# EAGLE design mod_io (EAGLE 7.5.0)
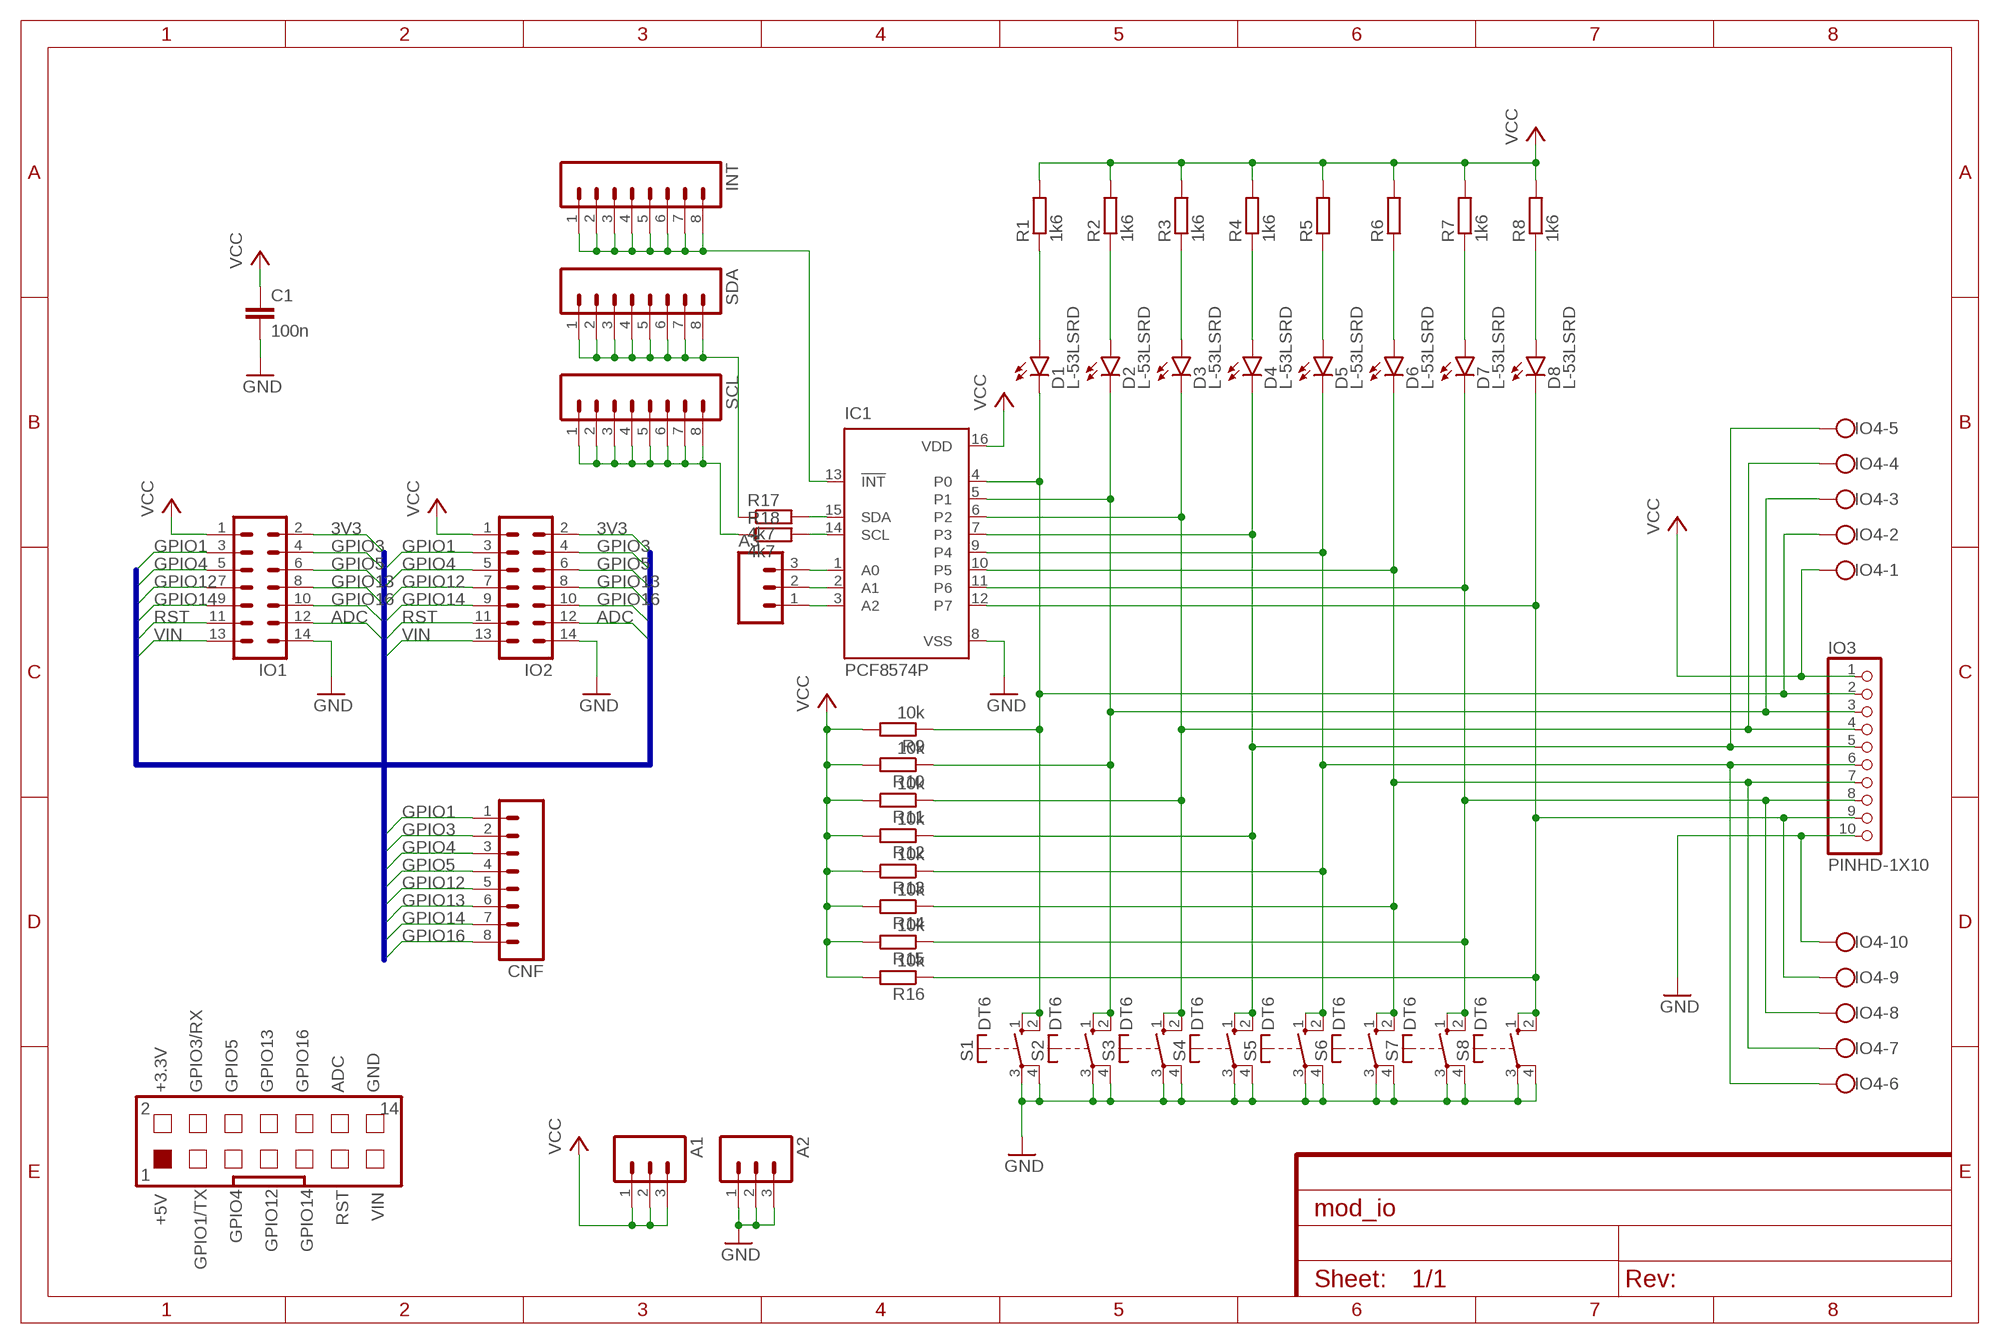
[diagram p0: schematic, sheet 1]
FRAME1 (FRAME-A4L): CNAME: I/O Expander for IoT Module; CREVISION: 1; DESIGNER: M.Vagovszky

## Parts
A1  M03LONGPADS  [1X03_LONGPADS]
A2  M03LONGPADS  [1X03_LONGPADS]
A3  M03LONGPADS  [1X03_LONGPADS]
C1  100n  C-EU050-025X075  [C050-025X075]
CNF  M08LONGPADS  [1X08_LONGPADS]
D1  L-53LSRD  LED5MM  [LED5MM]
D2  L-53LSRD  LED5MM  [LED5MM]
D3  L-53LSRD  LED5MM  [LED5MM]
D4  L-53LSRD  LED5MM  [LED5MM]
D5  L-53LSRD  LED5MM  [LED5MM]
D6  L-53LSRD  LED5MM  [LED5MM]
D7  L-53LSRD  LED5MM  [LED5MM]
D8  L-53LSRD  LED5MM  [LED5MM]
IC1  PCF8574P  [DIL16]
INT  M08LONGPADS  [1X08_LONGPADS]
IO1  14V  [14V]
IO2  14V  [14V]
IO3  PINHD-1X10  [1X10-BIG]
IO4  AK550/10  [AK550/10]
R1  1k6  R-EU_0207/10  [0207/10]
R2  1k6  R-EU_0207/10  [0207/10]
R3  1k6  R-EU_0207/10  [0207/10]
R4  1k6  R-EU_0207/10  [0207/10]
R5  R-EU_0207/10  [0207/10]
R6  R-EU_0207/10  [0207/10]
R7  1k6  R-EU_0207/10  [0207/10]
R8  1k6  R-EU_0207/10  [0207/10]
R9  10k  R-EU_0207/10  [0207/10]
R10  10k  R-EU_0207/10  [0207/10]
R11  10k  R-EU_0207/10  [0207/10]
R12  10k  R-EU_0207/10  [0207/10]
R13  10k  R-EU_0207/10  [0207/10]
R14  10k  R-EU_0207/10  [0207/10]
R15  10k  R-EU_0207/10  [0207/10]
R16  10k  R-EU_0207/10  [0207/10]
R17  4k7  R-EU_0207/10  [0207/10]
R18  4k7  R-EU_0207/10  [0207/10]
S1  DT6  [DT6]
S2  DT6  [DT6]
S3  DT6  [DT6]
S4  DT6  [DT6]
S5  DT6  [DT6]
S6  DT6  [DT6]
S7  DT6  [DT6]
S8  DT6  [DT6]
SCL  M08LONGPADS  [1X08_LONGPADS]
SDA  M08LONGPADS  [1X08_LONGPADS]

## Nets
3V3: IO1.2 IO2.2
ADC: IO1.12 IO2.12
GND: A2.1 A2.2 A2.3 C1.2 IC1.8(VSS) IO1.14 IO2.14 IO3.10 IO4.10 S1.3(P) S1.4(P) S2.3(P) S2.4(P) S3.3(P) S3.4(P) S4.3(P) S4.4(P) S5.3(P) S5.4(P) S6.3(P) S6.4(P) S7.3(P) S7.4(P) S8.3(P) S8.4(P)
GPIO1: CNF.1 IO1.3 IO2.3
GPIO3: CNF.2 IO1.4 IO2.4
GPIO4: CNF.3 IO1.5 IO2.5
GPIO5: CNF.4 IO1.6 IO2.6
GPIO12: CNF.5 IO1.7 IO2.7
GPIO13: CNF.6 IO1.8 IO2.8
GPIO14: CNF.7 IO1.9 IO2.9
GPIO16: CNF.8 IO1.10 IO2.10
N$1: D5.K(C) IC1.9(P4) IO3.6 IO4.6 R13.1 S5.1(S) S5.2(S)
N$2: D6.K(C) IC1.10(P5) IO3.7 IO4.7 R14.1 S6.1(S) S6.2(S)
N$3: D1.K(C) IC1.4(P0) IO3.2 IO4.2 R9.1 S1.1(S) S1.2(S)
N$4: D2.K(C) IC1.5(P1) IO3.3 IO4.3 R10.1 S2.1(S) S2.2(S)
N$5: D3.K(C) IC1.6(P2) IO3.4 IO4.4 R11.1 S3.1(S) S3.2(S)
N$6: D4.K(C) IC1.7(P3) IO3.5 IO4.5 R12.1 S4.1(S) S4.2(S)
N$7: D7.K(C) IC1.11(P6) IO3.8 IO4.8 R15.1 S7.1(S) S7.2(S)
N$8: D8.K(C) IC1.12(P7) IO3.9 IO4.9 R16.1 S8.1(S) S8.2(S)
N$9: D6.A R6.1
N$10: D5.A R5.1
N$11: D7.A R7.1
N$12: D8.A R8.1
N$13: D1.A R1.1
N$14: D2.A R2.1
N$15: D3.A R3.1
N$16: D4.A R4.1
N$17: IC1.13(!INT) INT.1 INT.2 INT.3 INT.4 INT.5 INT.6 INT.7 INT.8
N$18: A3.3 IC1.1(A0)
N$19: A3.2 IC1.2(A1)
N$20: A3.1 IC1.3(A2)
N$21: IC1.15(SDA) R17.2
N$22: IC1.14(SCL) R18.2
N$23: R17.1 SDA.1 SDA.2 SDA.3 SDA.4 SDA.5 SDA.6 SDA.7 SDA.8
N$25: R18.1 SCL.1 SCL.2 SCL.3 SCL.4 SCL.5 SCL.6 SCL.7 SCL.8
RST: IO1.11 IO2.11
VCC: A1.1 A1.2 A1.3 C1.1 IC1.16(VDD) IO1.1 IO2.1 IO3.1 IO4.1 R1.2 R2.2 R3.2 R4.2 R5.2 R6.2 R7.2 R8.2 R9.2 R10.2 R11.2 R12.2 R13.2 R14.2 R15.2 R16.2
VIN: IO1.13 IO2.13

## Buses
BUS:RST,ADC,GPIO16,GPIO[4..5],GPIO[12..14],GPIO1,GPIO3,VIN,3V3

## Notes on the sheet
- +3.3V | GPIO3/RX | GPIO5 | GPIO13 | GPIO16 | ADC | GND
- 2 | 14
- 1
- +5V | RST | VIN
- GPIO4
- GPIO12 | GPIO14
- GPIO1/TX

## Library data of the parts
A1-A3 = SparkFun-Connectors:M03: Header 3 Standard 3-pin 0.1" header. Use with straight break away headers (SKU : PRT-00116), right angle break away headers (PRT-00553), swiss pins (PRT-00743), machine pins (PRT-00117), and female headers (PRT-00115). Molex polarized connector foot print use with SKU : PRT-08232 with associated crimp pins and housings.
C1 = rcl:C-EU: CAPACITOR, European symbol
CNF INT SCL SDA = SparkFun-Connectors:M08: Header 8 Standard 8-pin 0.1" header. Use with straight break away headers (SKU : PRT-00116), right angle break away headers (PRT-00553), swiss pins (PRT-00743), machine pins (PRT-00117), and female headers (PRT-00115).
D1-D8 = SparkFun-LED:LED: LEDs Standard schematic elements and footprints for 5mm, 3mm, 1206, and 0603 sized LEDs. 5mm - Spark Fun Electronics SKU : COM-00529 (and others)
IC1 = micro-philips:PCF8574: I2C-Bus Remote 8-bit I/O expander http://www.semiconductors.philips.com/acrobat_download/datasheets/PCF8574_4.pdf; MPN: PCF8574PN; OC_FARNELL: 204020; OC_NEWARK: 11N8515
IO1 IO2 = con-harting-v:14V: CONNECTOR; OC_FARNELL: unknown; OC_NEWARK: unknown
IO3 = adafruit:PINHD-1X10: Pin header 1x10 0.1" spacing With round pins
IO4 = con-ptr500+:AK550/10: CONNECTOR
R1-R18 = resistor:R-EU_: RESISTOR, European symbol
S1-S8 = switch-misc:DT: ITT SWITCH

## Board
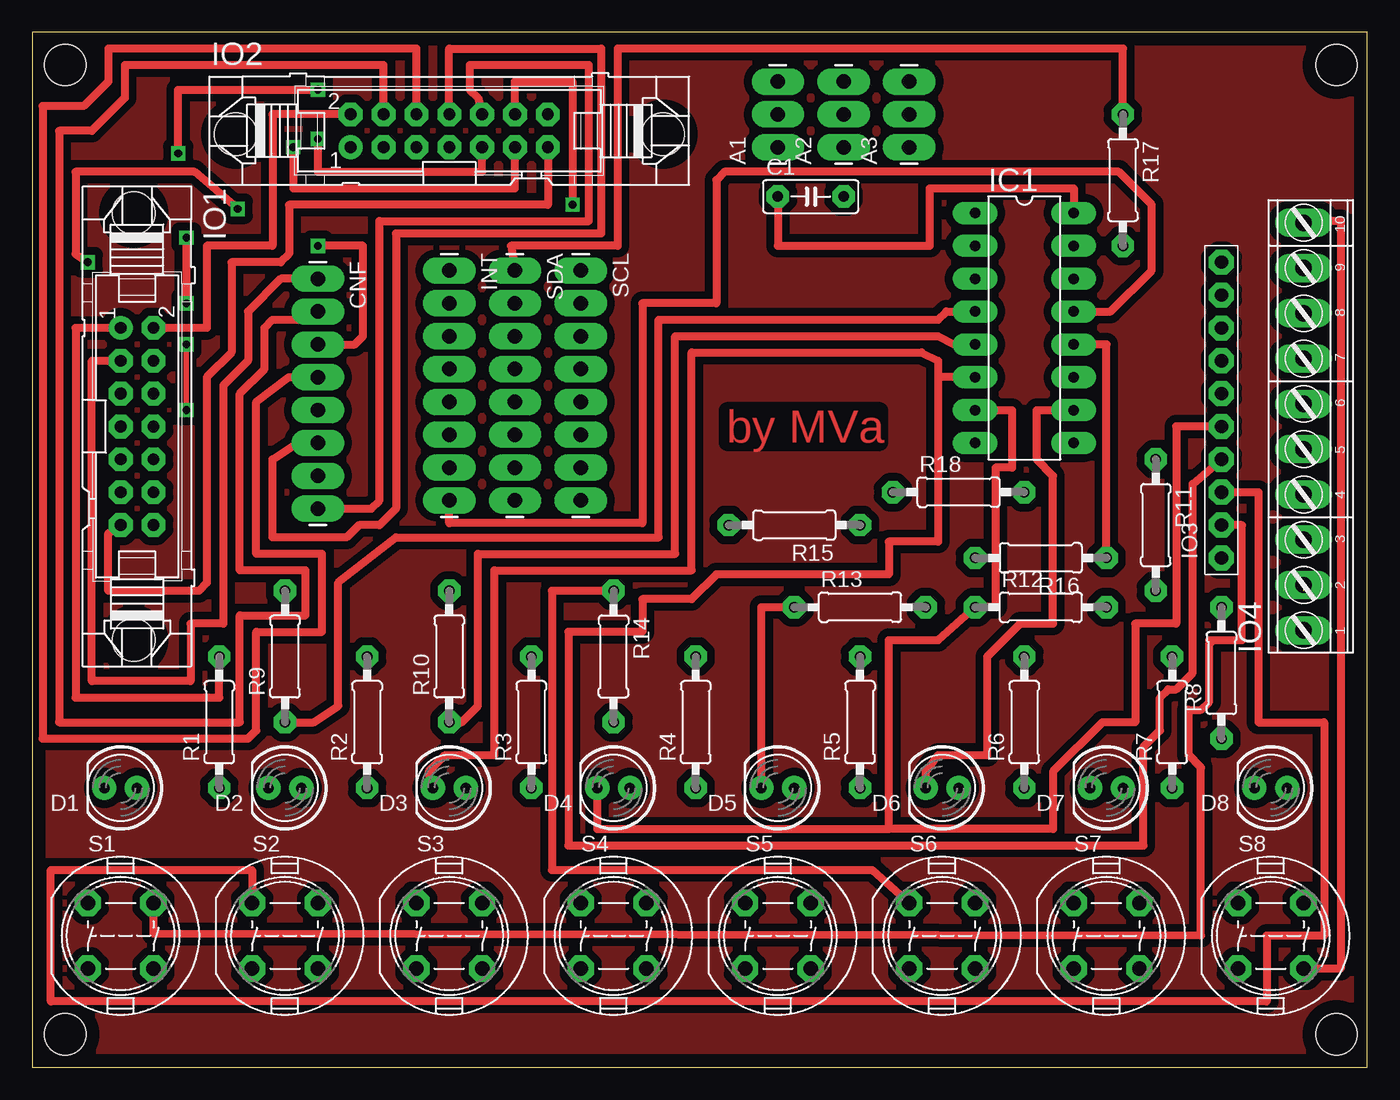
[diagram p1: board, top side]
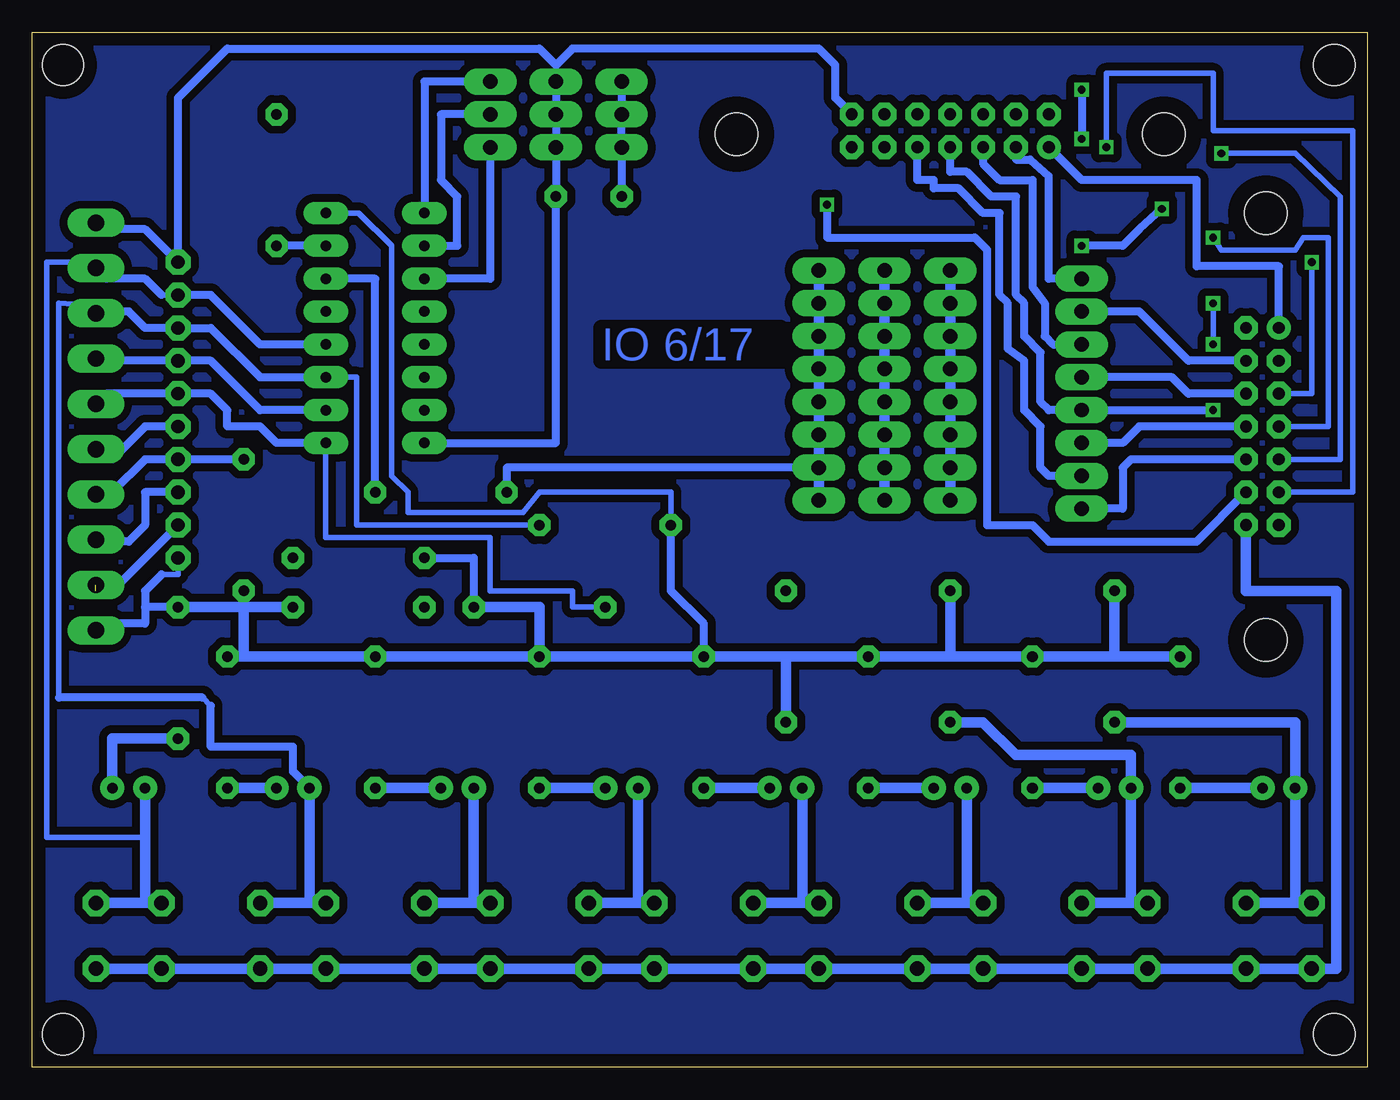
[diagram p2: board, bottom side, seen from below]

Size 103.17 x 80 mm. Coordinates in mm from the lower left corner, seen from the top.
Outline: 0,0 103.17,0 103.17,80 0,80 0,0
Copper layers (1*16): Top 0.035mm / dielectric 1.5mm / Bottom 0.035mm
Design rules "default *": minimum track width 10mil, minimum drill 20mil, track to track 15mil, track to pad 15mil, pad to pad 12mil, via to via 8mil, smd to smd 8mil, copper to edge 40mil, drill to drill 10mil, minimum pad ring 18mil, minimum via ring 10mil, stop-mask expansion 4mil, vias tented up to drill 0mil, thermal gap 10mil
Holes 3.2 mm at 2.54,77.47 100.81,77.47 100.81,2.54 2.54,2.54

### Footprints (pad centres in the part's own frame; a part is rotated, then mirrored left to right if it is on the bottom)
1X03_LONGPADS = drill 1.118 pad 1.88 long: 1 0,0; 2 2.54,0; 3 5.08,0
C050-025X075 = drill 0.813 octagon: 1 -2.54,0; 2 2.54,0
1X08_LONGPADS = drill 1.118 pad 1.88 long: 1 0,0; 2 2.54,0; 3 5.08,0; 4 7.62,0; 5 10.16,0; 6 12.7,0; 7 15.24,0; 8 17.78,0
LED5MM = drill 0.813 pad 1.88: A -1.27,0; K 1.27,0
DIL16 = drill 0.813 long: 1 -8.89,-3.81; 2 -6.35,-3.81; 3 -3.81,-3.81; 4 -1.27,-3.81; 5 1.27,-3.81; 6 3.81,-3.81; 7 6.35,-3.81; 8 8.89,-3.81; 9 8.89,3.81; 10 6.35,3.81; 11 3.81,3.81; 12 1.27,3.81; 13 -1.27,3.81; 14 -3.81,3.81; 15 -6.35,3.81; 16 -8.89,3.81
14V = drill 0.914: 1 -7.62,-1.27 | drill 0.914 octagon: 2 -7.62,1.27; 3 -5.08,-1.27; 4 -5.08,1.27; 5 -2.54,-1.27; 6 -2.54,1.27; 7 0,-1.27; 8 0,1.27; 9 2.54,-1.27; 10 2.54,1.27; 11 5.08,-1.27; 12 5.08,1.27; 13 7.62,-1.27; 14 7.62,1.27 | hole 3.302: 16.51,-0.254; -16.51,-0.254
1X10-BIG = drill 1.016 pad 1.778 octagon: 1 -11.43,0; 2 -8.89,0; 3 -6.35,0; 4 -3.81,0; 5 -1.27,0; 6 1.27,0; 7 3.81,0; 8 6.35,0; 9 8.89,0; 10 11.43,0
AK550/10 = drill 1.27 long: 1 -15.75,0; 2 -12.25,0; 3 -8.75,0; 4 -5.25,0; 5 -1.75,0; 6 1.75,0; 7 5.25,0; 8 8.75,0; 9 12.25,0; 10 15.75,0
0207/10 = drill 0.813 octagon: 1 -5.08,0; 2 5.08,0
DT6 = drill 1.118 octagon: 1 -2.54,2.54; 2 2.54,2.54; 3 2.54,-2.54; 4 -2.54,-2.54

### Placement (x,y rotation side)
A1  57.63,71.12 90 top
A2  62.71,71.12 90 top
A3  67.79,71.12 90 top
C1  60.17,67.31 0 top
CNF  22.07,60.96 270 top
D1  6.83,21.59 180 top
D2  19.53,21.59 180 top
D3  32.23,21.59 180 top
D4  44.93,21.59 180 top
D5  57.63,21.59 180 top
D6  70.33,21.59 180 top
D7  83.03,21.59 180 top
D8  95.73,21.59 180 top
IC1  76.68,57.15 270 top
INT  32.23,61.59 270 top
IO1  8.1,49.53 270 top
IO2  32.23,72.39 0 top
IO3  91.92,50.8 90 top
IO4  98.27,49.53 90 top
R1  14.45,26.67 90 top
R2  25.88,26.67 90 top
R3  38.58,26.67 90 top
R4  51.28,26.67 90 top
R5  63.98,26.67 90 top
R6  76.68,26.67 90 top
R7  88.11,26.67 90 top
R8  91.92,30.48 90 top
R9  19.53,31.75 90 top
R10  32.23,31.75 90 top
R11  86.84,41.91 270 top
R12  77.95,35.56 0 top
R13  63.98,35.56 0 top
R14  44.93,31.75 270 top
R15  58.9,41.91 180 top
R16  77.95,39.37 180 top
R17  84.3,68.58 270 top
R18  71.6,44.45 0 top
S1  6.83,10.16 0 top
S2  19.53,10.16 0 top
S3  32.23,10.16 0 top
S4  44.93,10.16 0 top
S5  57.63,10.16 0 top
S6  70.33,10.16 0 top
S7  83.03,10.16 0 top
S8  95.73,10.16 0 top
SCL  42.39,61.59 270 top
SDA  37.31,61.59 270 top

### Tracks (layer width: path | path; a pad name or v marks a point on that pad's centre or on a via)
3V3
  Top 0.61: IO2.2 18.57,73.66 18.57,63.5 13.49,63.5 13.49,57.15 IO1.2
ADC  (via drill 0.6)
  Top 0.61: IO2.12 37.31,76.2 41.75,76.2 v41.75,66.67
  Bottom 0.61: IO1.12 13.18,40.64 24.61,40.64 25.88,41.91 29.37,41.91 29.37,63.18 30.32,64.14 41.75,64.14 v41.75,66.67
GND
  Top 0.406: 97.95,65.41 IO4.10
  Top 0.61: 97.95,65.41 101.12,65.41 101.12,7.62 S8.3
  Bottom 0.406: S2.3 23.34,7.62 | 56.36,7.62 S5.4 | 97.76,64.77 IO4.10 | 62.71,77.47 A2.3
  Bottom 0.61: 97.76,64.77 94.46,64.77 IO3.10 91.92,74.93 88.11,78.74 63.98,78.74 62.71,77.47 61.44,78.74 42.39,78.74 41.12,77.47 41.12,74.93 IO2.14 | A2.3 A2.2 A2.1 C1.2 62.71,48.26 IC1.8
  Bottom 0.813: S8.3 S8.4 S7.3 S7.4 S6.3 S6.4 S5.3 S5.4 S4.3 S4.4 S3.3 S3.4 S2.3 S2.4 S1.3 S1.4 2.38,7.62 2.38,36.83 9.37,36.83 IO1.14
GPIO1
  Top 0.61: CNF.1 19.21,60.96 16.67,58.42 16.67,54.61 14.76,52.7 14.76,34.29 12.22,34.29 12.22,29.84 4.6,29.84 4.6,54.61 IO1.3
  Bottom 0.61: CNF.1 24.61,60.96 24.61,68.9 26.03,70.17 27.15,70.17 IO2.3
GPIO3
  Top 0.406: 21.11,57.78 CNF.2
  Top 0.61: IO2.4 27.15,77.47 7.14,77.47 7.14,74.93 4.6,72.39 2.06,72.39 2.06,26.67 16.03,26.67 16.03,34.92 21.11,34.92 21.11,38.42 16.03,38.42 16.03,52.07 17.94,53.98 17.94,57.15 18.57,57.78 21.11,57.78
  Bottom 0.61: IO1.4 13.81,54.61 17.62,58.42 CNF.2
GPIO4  (via drill 0.6)
  Top 0.61: CNF.3 24.92,55.88 25.56,56.52 25.56,63.5 v22.07,63.5 | v15.87,66.36 12.54,69.22 3.33,69.22 3.33,62.87 v4.29,62.23
  Bottom 0.406: v4.29,62.23 4.29,52.07 IO1.5
  Bottom 0.61: IO2.5 29.69,69.85 28.42,68.58 25.88,68.58 25.88,60.33 24.92,59.05 24.92,56.52 24.29,55.88 CNF.3 | v15.87,66.36 17.62,64.77 18.89,63.5 v22.07,63.5
GPIO5
  Top 0.61: IO2.6 29.69,78.74 5.87,78.74 5.87,76.2 3.97,74.3 0.79,74.3 0.79,25.4 16.67,25.4 17.3,26.04 17.3,33.66 22.38,33.66 22.38,39.69 17.3,39.69 17.3,51.44 19.84,53.34 CNF.4
  Bottom 0.61: IO1.6 13.81,52.07 15.08,53.34 CNF.4
GPIO12  (via drill 0.6)
  Top 0.406: v11.91,50.8 v11.91,55.88
  Top 0.61: v11.91,64.14 v11.91,59.05
  Bottom 0.406: IO1.7 3.02,49.53 3.02,64.14 4.92,64.14 5.56,63.18 11.27,63.18 v11.91,64.14 | v11.91,59.05 v11.91,55.88
  Bottom 0.61: IO2.7 32.23,69.22 30.96,69.22 29.05,67.31 27.15,67.31 27.15,59.69 26.51,59.05 26.51,56.52 25.24,55.24 25.24,51.44 24.61,50.8 CNF.5 v11.91,50.8
GPIO13
  Top 0.61: IO2.8 32.23,78.74 43.97,78.74 43.97,64.45 28.1,64.45 28.1,43.18 26.83,41.91 25.24,41.91 24.29,40.96 18.57,40.96 18.57,46.99 20.48,48.26 CNF.6
  Bottom 0.61: IO1.8 17.62,49.53 18.89,48.26 CNF.6
GPIO14  (via drill 0.6)
  Top 0.61: v11.27,70.64 11.27,75.56 v22.07,75.56 | v22.07,71.75 22.07,69.22 34.77,69.22 IO2.9
  Bottom 0.406: 34.77,70.48 IO2.9 | IO1.9 2.06,46.99 2.06,67.31 5.56,70.64 v11.27,70.64
  Bottom 0.61: CNF.7 24.61,45.72 25.24,46.35 25.24,49.53 26.51,50.8 26.51,54.61 27.78,55.56 27.78,59.05 28.42,59.69 28.42,66.04 29.69,66.04 31.59,67.94 33.5,67.94 33.5,68.58 34.77,68.58 34.77,70.48 | v22.07,75.56 v22.07,71.75
GPIO16
  Top 0.61: CNF.8 26.19,43.18 26.83,43.81 26.83,65.41 43.02,65.41 43.02,77.47 33.81,77.47 33.81,75.56 34.45,74.93 IO2.10
  Bottom 0.61: IO1.10 18.26,46.99 18.89,46.35 18.89,43.18 CNF.8
N$1
  Top 0.61: D5.K 56.36,35.56 R13.1
  Bottom 0.406: S5.1 56.36,12.7 | 97.48,52.07 IO4.6 | R13.1 61.44,35.56 61.44,36.83 67.79,36.83 67.79,40.96 80.49,40.96 IC1.9
  Bottom 0.61: 97.48,52.07 IO3.6 89.38,52.07 88.11,50.8 88.11,49.53 85.57,49.53 84.3,48.26 IC1.9
  Bottom 0.813: S5.2 S5.1 | 56.36,12.7 D5.K
N$2
  Top 0.61: R14.1 40.16,36.83 40.16,15.24 64.93,15.24 S6.1 | D6.K 69.06,22.86 70.01,24.13 73.82,24.13 73.82,31.75 76.36,34.29 78.9,34.29 78.9,45.72 77.63,46.99 77.63,50.8 IC1.10
  Bottom 0.406: S6.1 69.06,12.7 | 98.1,54.61 IO4.7
  Bottom 0.61: 98.1,54.61 IO3.7 89.38,54.61 85.57,50.8 IC1.10
  Bottom 0.813: S6.1 S6.2 | 69.06,12.7 D6.K
N$3  (1 unrouted)
  Top 0.61: R9.1 21.75,26.67 23.65,27.94 23.65,37.47 28.1,40.96 48.42,40.96 48.42,57.78 70.01,57.78 70.64,58.42 IC1.4 | S1.2 9.37,10.32 90.33,10.16 90.33,23.18 89.38,24.13 89.38,27.62 90.33,27.62 90.96,28.26 90.96,32.7 91.28,33.02 | 90.96,33.02 91.28,33.02 | 91.28,33.02 93.5,33.02 93.5,41.91 IO3.2
  Bottom 0.406: S1.1 5.56,12.7 | 97,36.83 98.27,36.83
  Bottom 0.61: IO3.2 97,36.83
  Bottom 0.813: S1.1 S1.2 | 5.56,12.7 D1.K 5.56,26.67 R9.1
N$4
  Top 0.61: R10.1 33.18,26.67 34.45,27.94 34.45,39.69 49.69,39.69 49.69,56.52 70.01,56.52 71.28,55.88 IC1.5 | IO3.3 94.77,44.45 94.77,26.67 99.85,26.67 99.85,10.16 95.41,10.16 95.41,5.08 1.43,5.08 1.43,15.24 16.99,15.24 S2.1
  Bottom 0.406: S2.1 18.26,12.7 | 98.13,40.64 IO4.3
  Bottom 0.61: IO3.3 94.46,44.45 94.46,41.91 95.73,40.64 98.13,40.64
  Bottom 0.813: S2.2 S2.1 | 18.26,12.7 D2.K 18.26,24.13 27.15,24.13 29.69,26.67 R10.1
N$5
  Top 0.61: D3.K 30.64,22.86 31.91,24.13 35.72,24.13 35.72,38.42 50.96,38.42 50.96,55.24 68.74,55.24 70.01,54.61 70.01,53.34 | IC1.6 70.01,53.34 | 70.01,53.34 70.01,40.64 66.2,40.64 66.2,38.1 52.86,38.1 50.96,36.2 47.15,36.2 47.15,33.66 41.43,33.66 41.43,17.14 85.88,17.14 85.88,24.77 87.15,26.04 87.15,28.57 87.79,29.21 88.42,29.21 89.69,30.48 89.69,45.09 IO3.4
  Bottom 0.406: S3.1 30.96,12.7 | 97,44.45 98.1,44.45 IO4.4
  Bottom 0.61: 97,44.45 94.46,46.99 IO3.4 R11.1
  Bottom 0.813: S3.2 S3.1 | 30.96,12.7 D3.K
N$6
  Top 0.61: D4.K 43.66,18.41 66.2,18.41 | 66.2,18.41 66.2,33.02 70.01,33.02 R12.1 74.45,35.56 74.45,46.35 75.72,46.35 75.72,50.8 IC1.7 | IO3.5 88.42,49.53 88.42,34.29 85.25,34.29 85.25,26.67 82.71,26.67 78.9,22.86 78.9,18.41 66.2,18.41
  Bottom 0.406: S4.1 43.66,12.7 | 97,46.99 97.48,46.99 IO4.5
  Bottom 0.61: IO3.5 94.46,49.53 97,46.99
  Bottom 0.813: S4.2 S4.1 | 43.66,12.7 D4.K
N$7
  Bottom 0.406: S7.1 81.76,12.7 | 98.13,58.42 IO4.8 98.76,58.91 101.12,59.05 101.12,28.57 | R15.1 78.1,41.91 78.1,53.34 IC1.11 | 89.38,27.94 90.01,28.57
  Bottom 0.61: 98.13,58.42 95.73,58.42 94.46,57.15 IO3.8 89.38,57.15 85.57,53.34 IC1.11 | D7.K 83.03,22.86 83.03,24.77 89.38,24.77 89.38,27.94 | 90.01,28.57 101.12,28.57
  Bottom 0.813: S7.2 S7.1 | 81.76,12.7 D7.K
N$8
  Top 0.61: R16.1 83.03,55.88 IC1.12
  Bottom 0.406: S8.1 94.46,12.7 | IO3.9 93.19,59.69 | 97.45,60.96 IO4.9 98.72,62.23 102.08,62.23 102.08,17.78 94.46,17.78
  Bottom 0.61: 93.19,59.69 94.46,60.96 97.45,60.96 | IO3.9 89.38,59.69 85.57,55.88 IC1.12
  Bottom 0.813: S8.2 S8.1 | 94.46,12.7 94.46,17.78 D8.K
N$9
  Bottom 0.813: D6.A R6.1
N$10
  Bottom 0.813: D5.A R5.1
N$11
  Bottom 0.813: D7.A R7.1
N$12
  Bottom 0.813: D8.A 97,25.4 R8.1
N$13
  Bottom 0.813: D1.A R1.1
N$14
  Bottom 0.813: D2.A R2.1
N$15
  Bottom 0.813: D3.A R3.1
N$16
  Bottom 0.813: D4.A R4.1
N$17
  Top 0.61: IC1.13 83.34,58.42 86.52,61.59 86.52,66.67 83.98,69.22 53.5,69.22 52.86,68.58 52.86,59.05 47.15,59.05 47.15,42.07 32.23,42.07 INT.8
  Bottom 0.406: INT.6 32.23,46.99
  Bottom 0.813: INT.8 INT.7 INT.6 INT.5 INT.4 INT.3 INT.2 INT.1
N$18
  Bottom 0.61: A3.3 72.87,76.2 IC1.1
N$19
  Bottom 0.61: A3.2 71.6,73.66 71.6,68.58 70.33,67.31 70.33,63.5 IC1.2
N$20
  Bottom 0.61: A3.1 67.79,60.96 IC1.3
N$21
  Bottom 0.61: IC1.15 R17.2
N$22
  Bottom 0.61: R18.2 76.68,60.96 IC1.14
N$23
  Top 0.61: R17.1 84.3,78.74 45.24,78.74 45.24,63.5 36.99,63.5 SDA.1
  Bottom 0.406: 37.31,44.45 SDA.7
  Bottom 0.813: SDA.1 SDA.2 SDA.3 SDA.4 SDA.5 SDA.6 SDA.7 SDA.8
N$24
  pour Top (isolate 0.61): 0,80.01 0,0 103.19,0 103.19,80.01
N$25
  Bottom 0.61: SCL.7 66.52,46.35 R18.1
  Bottom 0.813: SCL.1 SCL.2 SCL.3 SCL.4 SCL.5 SCL.6 SCL.7 SCL.8
N$26
  pour Bottom (isolate 0.61): 0,80.01 0,0 103.19,0 103.19,80.01
RST  (via drill 0.6)
  Top 0.61: v20.16,71.12 20.16,67.94 37.31,67.94 IO2.11
  Bottom 0.406: IO1.11 1.11,44.45 1.11,72.39 11.91,72.39 11.91,76.83 20.16,76.83 v20.16,71.12
VCC
  Top 0.61: C1.1 57.63,63.5 69.37,63.5 69.37,67.94 80.49,67.94 IC1.16 | IO1.1 3.33,57.15 3.33,28.57 14.45,28.57 R1.2
  Bottom 0.406: IO3.1 91.92,38.1 93.19,38.1 | 97.76,34.29 IO4.1 | R7.2 86.84,31.75 | R15.2 53.82,44.45 63.98,44.45 65.25,42.86 74.14,42.86 74.14,44.45 75.41,45.72 75.41,63.5 77.95,66.04 IC1.16
  Bottom 0.61: 93.19,38.1 94.46,36.83 94.46,35.56 | 94.46,35.56 94.46,34.29 97.76,34.29 | R8.2 94.46,35.56 | A1.3 A1.2 A1.1 C1.1 | IO1.1 6.83,61.91 13.18,61.91 13.18,68.58 22.07,68.58 IO2.1 | R4.2 51.28,34.29 53.82,36.83 R15.2 | R16.2 69.06,39.37 R13.2
  Bottom 0.813: R1.2 19.53,31.75 | 19.53,31.75 R9.2 | 19.53,31.75 R2.2 32.23,31.75 | 32.23,31.75 R10.2 | 32.23,31.75 R3.2 44.93,31.75 | 44.93,31.75 R14.2 | 44.93,31.75 R4.2 R5.2 | R5.2 R6.2 R7.2 | 86.84,31.75 86.84,35.56 | 86.84,35.56 R11.2 | R12.2 86.84,35.56 | R8.2 86.84,35.56 | R13.2 63.98,35.56 R5.2
VIN
  Top 0.61: IO2.13 39.85,66.67 19.84,66.67 19.84,62.87 19.21,62.23 15.4,62.23 15.4,55.24 13.49,53.34 13.49,37.47 12.86,36.83 5.87,36.83 5.87,41.27 IO1.13

### Text on the board
Top: by MVa
Bottom: IO 6/17